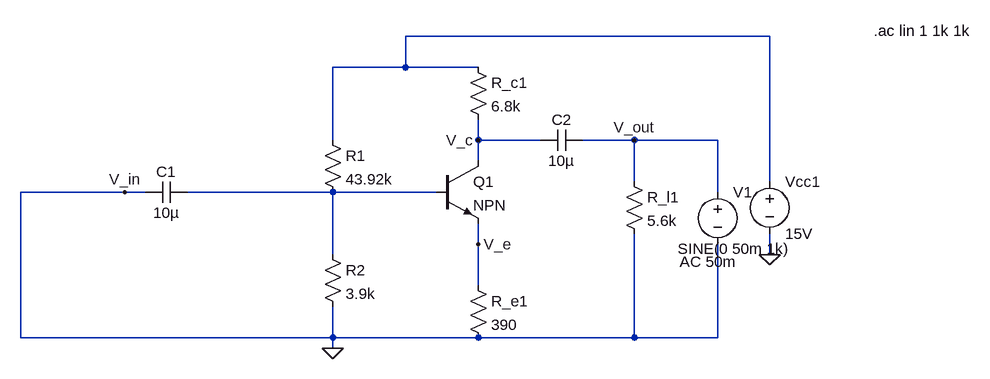
[diagram p0: schematic R_output_with_load.asc]
R_output_with_load.asc, the LTspice schematic file:
Version 4
SHEET 1 880 680
WIRE 480 -48 -80 -48
WIRE -80 0 -80 -48
WIRE -80 0 -192 0
WIRE 32 0 -80 0
WIRE -192 112 -192 0
WIRE 32 112 32 80
WIRE 128 112 32 112
WIRE 272 112 192 112
WIRE 400 112 272 112
WIRE 32 144 32 112
WIRE 272 176 272 112
WIRE 480 176 480 -48
WIRE -512 192 -672 192
WIRE -480 192 -512 192
WIRE -192 192 -416 192
WIRE -32 192 -192 192
WIRE 400 192 400 112
WIRE 32 272 32 240
WIRE -192 288 -192 192
WIRE 480 288 480 256
WIRE 32 336 32 272
WIRE -672 416 -672 192
WIRE -192 416 -192 368
WIRE -192 416 -672 416
WIRE 32 416 -192 416
WIRE 272 416 272 256
WIRE 272 416 32 416
WIRE 400 416 400 272
WIRE 400 416 272 416
WIRE -192 432 -192 416
FLAG -192 432 0
FLAG 480 288 0
FLAG 32 112 V_c
FLAG 32 272 V_e
FLAG -512 192 V_in
FLAG 272 112 V_out
SYMBOL npn -32 144 R0
SYMATTR InstName Q1
SYMBOL res 16 -16 R0
SYMATTR InstName R_c1
SYMATTR Value 6.8k
SYMBOL res -208 96 R0
SYMATTR InstName R1
SYMATTR Value 43.92k
SYMBOL res -208 272 R0
SYMATTR InstName R2
SYMATTR Value 3.9k
SYMBOL res 16 320 R0
SYMATTR InstName R_e1
SYMATTR Value 390
SYMBOL res 256 160 R0
SYMATTR InstName R_l1
SYMATTR Value 5.6k
SYMBOL cap -416 176 R90
WINDOW 0 0 32 VBottom 2
WINDOW 3 32 32 VTop 2
SYMATTR InstName C1
SYMATTR Value 10µ
SYMBOL cap 128 128 R270
WINDOW 0 32 32 VTop 2
WINDOW 3 0 32 VBottom 2
SYMATTR InstName C2
SYMATTR Value 10µ
SYMBOL voltage 480 160 R0
WINDOW 123 0 0 Left 0
WINDOW 39 0 0 Left 0
SYMATTR InstName Vcc1
SYMATTR Value 15V
SYMBOL voltage 400 176 R0
WINDOW 3 -61 103 Left 2
WINDOW 123 -58 123 Left 2
WINDOW 39 0 0 Left 0
SYMATTR Value SINE(0 50m 1k)
SYMATTR Value2 AC 50m
SYMATTR InstName V1
TEXT 640 -56 Left 2 !.ac lin 1 1k 1k

The netlist it stands for:
* R_output_with_load.asc
Q1 V_c N002 V_e 0 NPN
R_c1 N001 V_c 6.8k
R1 N001 N002 43.92k
R2 N002 0 3.9k
R_e1 V_e 0 390
R_l1 V_out 0 5.6k
C1 N002 0 10µ
C2 V_c V_out 10µ
Vcc1 N001 0 15V
V1 V_out 0 SINE(0 50m 1k) AC 50m
.model NPN NPN
.model PNP PNP
.lib standard.bjt
.ac lin 1 1k 1k
.backanno
.end